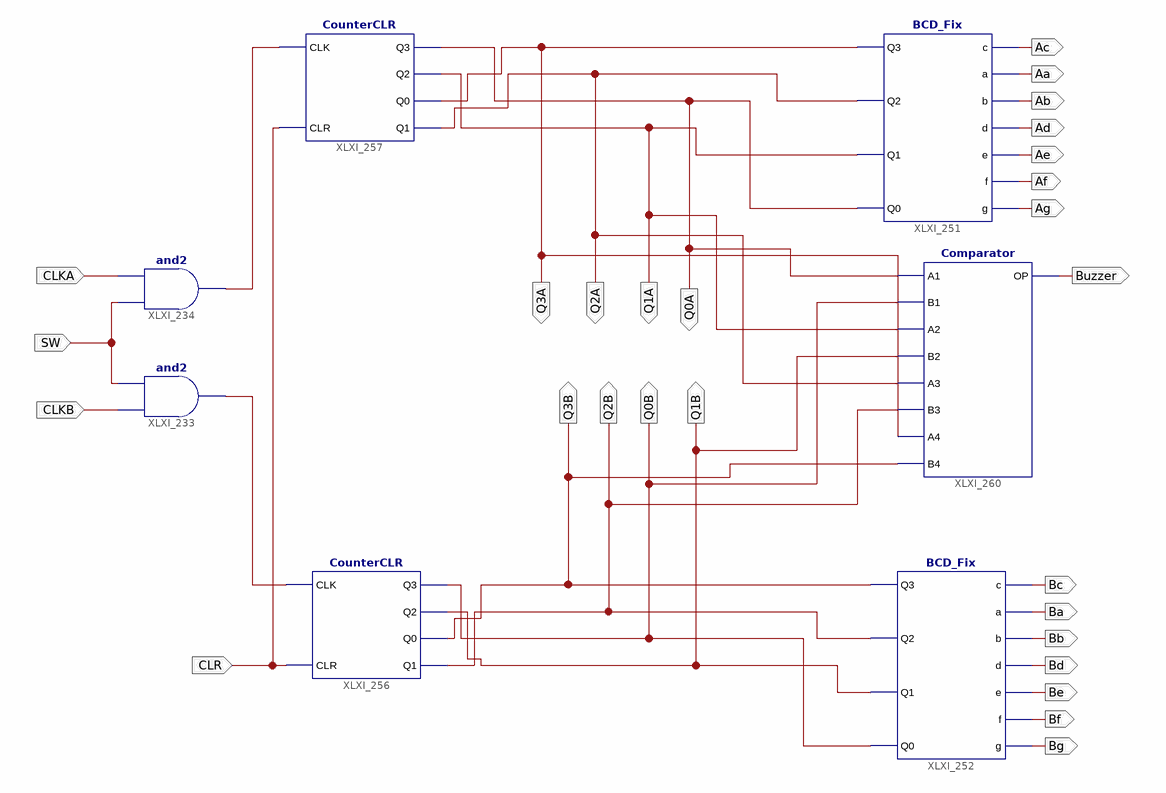
[diagram p0: schematic sheet 1]
// Xilinx ISE schematic Lab06_Schematic.sch (spartan6) as structural Verilog: 7 symbols, 27 ports
module Lab06_Schematic (
  input  CLKA,
  input  CLKB,
  input  SW,
  input  CLR,
  output Q3A,
  output Q2A,
  output Q0A,
  output Q1A,
  output Q3B,
  output Q2B,
  output Q0B,
  output Q1B,
  output Buzzer,
  output Ab,
  output Aa,
  output Ad,
  output Ae,
  output Af,
  output Ag,
  output Ac,
  output Bb,
  output Bc,
  output Bd,
  output Be,
  output Bf,
  output Bg,
  output Ba
);

  wire XLXN_414, XLXN_415;

  and XLXI_233 (XLXN_414, CLKB, SW);
  and XLXI_234 (XLXN_415, SW, CLKA);
  BCD_Fix XLXI_251 (.Q3(Q3A), .Q2(Q2A), .Q1(Q1A), .Q0(Q0A), .c(Ac), .a(Aa), .b(Ab), .d(Ad), .e(Ae), .f(Af), .g(Ag));
  BCD_Fix XLXI_252 (.Q3(Q3B), .Q2(Q2B), .Q1(Q1B), .Q0(Q0B), .c(Bc), .a(Ba), .b(Bb), .d(Bd), .e(Be), .f(Bf), .g(Bg));
  CounterCLR XLXI_256 (.CLK(XLXN_414), .CLR(CLR), .Q3(Q0B), .Q2(Q1B), .Q0(Q3B), .Q1(Q2B));
  CounterCLR XLXI_257 (.CLK(XLXN_415), .CLR(CLR), .Q3(Q0A), .Q2(Q1A), .Q0(Q3A), .Q1(Q2A));
  Comparator XLXI_260 (.A1(Q0A), .B1(Q0B), .A2(Q1A), .B2(Q1B), .A3(Q2A), .B3(Q2B), .A4(Q3A), .B4(Q3B), .OP(Buzzer));
endmodule
